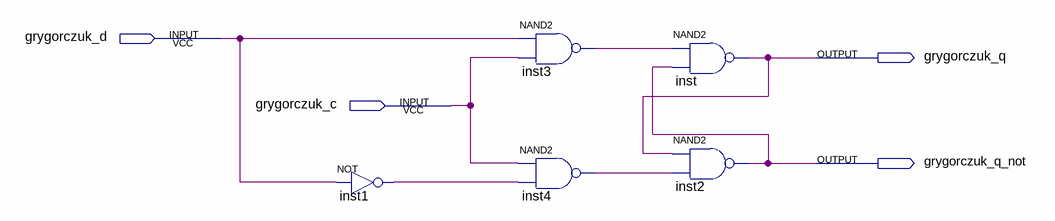
[diagram p0: schematic sheet]
// Quartus schematic D_LATCH.bdf as structural Verilog: 5 symbols, 4 pins
module D_LATCH (
  input  grygorczuk_d,
  input  grygorczuk_c,
  output grygorczuk_q,
  output grygorczuk_q_not
);

  wire inst1_out, inst3_out, inst4_out;

  not inst1 (inst1_out, grygorczuk_d);
  nand inst3 (inst3_out, grygorczuk_d, grygorczuk_c);
  nand inst4 (inst4_out, grygorczuk_c, inst1_out);
  nand inst (grygorczuk_q, inst3_out, grygorczuk_q_not);
  nand inst2 (grygorczuk_q_not, grygorczuk_q, inst4_out);
endmodule
